# EasyEDA Pro project 四轮车板子.epro, schematic Schematic3
Create Date: 2023-07-01; Page Name: P1; Project Name: 国光_无敌车; Schematic Name: Schematic3; Update Date: 2023-07-01; Company: 嘉立创EDA; Page Size: A4; Version: V1.0
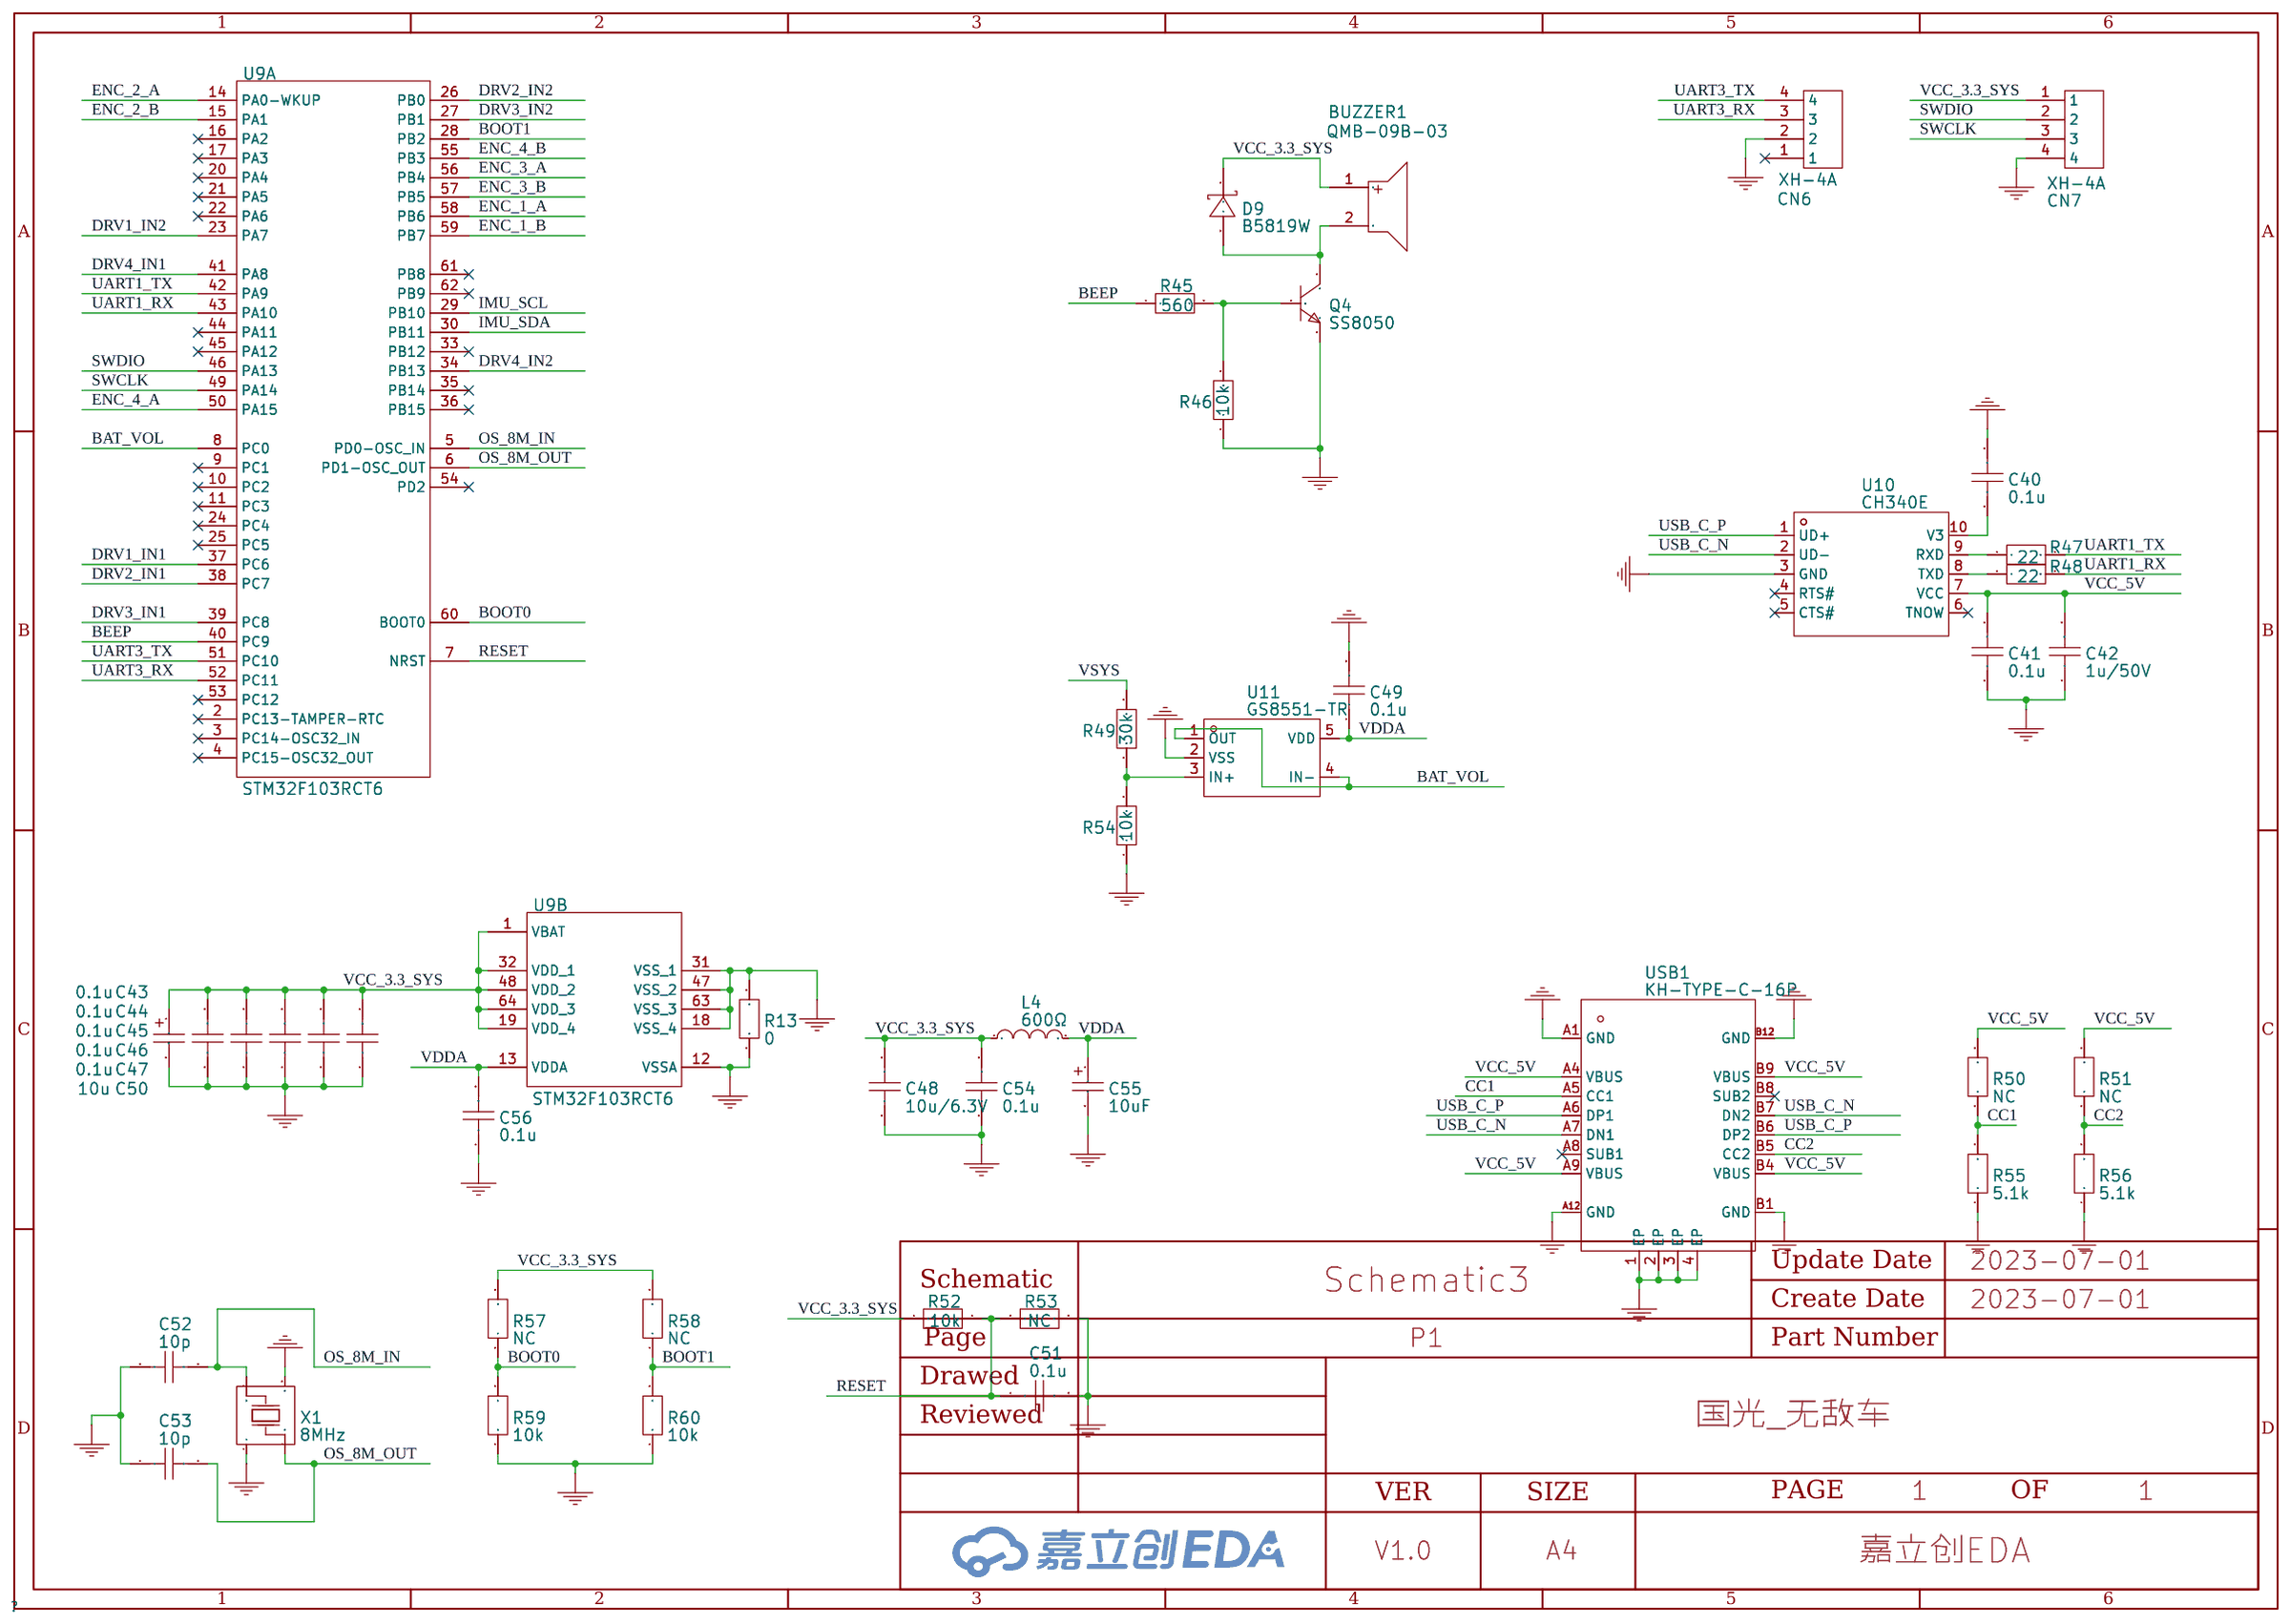
[diagram p0: schematic sheet]

## Parts
BUZZER1  QMB-09B-03  [BUZ-TH_BD9.0-P4.00-D0.6-FD]
C40  0.1u  [C0402]
C41  0.1u  [C0402]
C42  1u/50V  [C0603]
C43  0.1u  [C0402]
C44  0.1u  [C0402]
C45  0.1u  [C0402]
C46  0.1u  [C0402]
C47  0.1u  [C0402]
C48  10u/6.3V  [C0603]
C49  0.1u  [C0402]
C50  10u  [CAP-SMD_L3.2-W1.6-R-RD]
C51  0.1u  [C0402]
C52  10p  [C0402]
C53  10p  [C0402]
C54  0.1u  [C0402]
C55  10uF  [CAP-SMD_L3.2-W1.6-R-RD]
C56  0.1u  [C0402]
CN6  XH-4A  [CONN-TH_4P-P2.50_XH-4A]
CN7  XH-4A  [CONN-TH_4P-P2.50_XH-4A]
D9  B5819W  [SOD-123_L2.8-W1.8-LS3.7-RD]
L4  600Ω  [L1206]
Q4  SS8050  [SOT-23-3_L2.9-W1.3-P1.90-LS2.4-BR]
R13  0  [R0603]
R45  560  [R0402]
R46  10k  [R0402]
R47  22  [R0402]
R48  22  [R0402]
R49  30k  [R0402]
R50  NC  [R0402]
R51  NC  [R0402]
R52  10k  [R0402]
R53  NC  [R0402]
R54  10k  [R0402]
R55  5.1k  [R0402]
R56  5.1k  [R0402]
R57  NC  [R0402]
R58  NC  [R0402]
R59  10k  [R0402]
R60  10k  [R0402]
U9  STM32F103RCT6  [LQFP-64_L10.0-W10.0-P0.50-LS12.0-BL]  (sections 1,2)
U10  CH340E  [MSOP-10_L3.0-W3.0-P0.50-LS5.0-BL]
U11  GS8551-TR  [SOT-23-5_L3.0-W1.7-P0.95-LS2.8-BR]
USB1  KH-TYPE-C-16P  [USB-C-SMD_KH-TYPE-C-16P]
X1  8MHz  [OSC-SMD_4P-L3.2-W2.5-BL]

## Library data of the parts
BUZZER1 = QMB-09B-03: link: https://item.szlcsc.com/173200.html; 3DModel: BUZ-TH_D9.0-H5.5-P4.0; Supplier: LCSC; Manufacturer: HNDZ; Supplier Part: C96256; JLCPCB Part Class: ExtendedPart
C40 C41 C43-C47 C49 C51 C54 C56 = 0.1u: link: https://item.szlcsc.com/15869.html; 3DModel: C0402_L1.0-W0.5-H0.5
C42 = 1u/50V: link: https://item.szlcsc.com/362304.html; 3DModel: C0603_L1.6-W0.8-H0.8
C48 = 10u/6.3V: link: https://item.szlcsc.com/362304.html; 3DModel: C0603_L1.6-W0.8-H0.8
C50 = 10u: link: https://item.szlcsc.com/210648.html; 3DModel: CASE-A_L3.2-W1.6-H1.6; Supplier: LCSC; Manufacturer: AVX; Manufacturer Part: TAJA106K016RNJ; Supplier Part: C7171; JLCPCB Part Class: BasicPart
C52 C53 = 10p: link: https://item.szlcsc.com/15869.html; 3DModel: C0402_L1.0-W0.5-H0.5
C55 = 10uF: link: https://item.szlcsc.com/210648.html; 3DModel: CASE-A_L3.2-W1.6-H1.6; Supplier: LCSC; Manufacturer: AVX; Manufacturer Part: TAJA106K016RNJ; Supplier Part: C7171; JLCPCB Part Class: BasicPart
CN6 CN7 = XH-4A: link: https://atta.szlcsc.com/upload/public/pdf/source/20170919/C37815_1505787307039977083.pdf; Supplier: LCSC; Manufacturer: BOOMELE; Supplier Part: C37815; JLCPCB Part Class: ExtendedPart
D9 = B5819W: link: https://item.szlcsc.com/301422.html; Supplier: LCSC; Manufacturer: MDD; Supplier Part: C64885; JLCPCB Part Class: ExtendedPart
L4 = 600Ω: link: https://item.szlcsc.com/375393.html; 3DModel: L1206_L3.2-W1.6-H1.1; Supplier: LCSC; Manufacturer: FH; Manufacturer Part: CBW321609U601T; Supplier Part: C73732; JLCPCB Part Class: ExtendedPart
Q4 = SS8050: link: https://www.diodes.com/assets/Package-Files/SOT23.pdf; 3DModel: SOT-23-3P_L2.9-W1.3-H1.0-LS2.4-P0.95; Supplier: LCSC; Supplier Part: C908250; Manufacturer: FUXINSEMI; JLCPCB Part Class: ExtendedPart
R13 = 0: 3DModel: R0603_L1.6-W0.8-H0.8; link: https://www.mouser.in/datasheet/2/447/PYu_RT_1_to_0_01_RoHS_L_11-1669912.pdf
R45 = 560: link: https://item.szlcsc.com/323315.html; 3DModel: R0402_L1.0-W0.5-H0.5
R46 R52 R54 R59 R60 = 10k: link: https://item.szlcsc.com/323315.html; 3DModel: R0402_L1.0-W0.5-H0.5
R47 R48 = 22: link: https://item.szlcsc.com/323315.html; 3DModel: R0402_L1.0-W0.5-H0.5
R49 = 30k: link: https://item.szlcsc.com/323315.html; 3DModel: R0402_L1.0-W0.5-H0.5
R50 R51 R53 R57 R58 = NC: link: https://item.szlcsc.com/323315.html; 3DModel: R0402_L1.0-W0.5-H0.5
R55 R56 = 5.1k: link: https://item.szlcsc.com/323315.html; 3DModel: R0402_L1.0-W0.5-H0.5
U9 = STM32F103RCT6: link: https://item.szlcsc.com/92458.html; 3DModel: LQFP-64_L10.0-W10.0-H1.4-LS12.0-P0.50; Supplier: LCSC; Manufacturer: STMicroelectronics; image: //image.lceda.cn/szlcsc/C8323.jpg; Supplier Part: C8323; JLCPCB Part Class: ExtendedPart
U10 = CH340E: link: https://item.szlcsc.com/221388.html; 3DModel: MSOP-10_L3.0-W3.0-H1.1-LS5.0-P0.50; Supplier: LCSC; Manufacturer: WCH; Supplier Part: C99652; JLCPCB Part Class: ExtendedPart
U11 = GS8551-TR: link: https://item.szlcsc.com/236104.html; 3DModel: SOT-23-5_L2.9-W1.6-H1.1-LS2.8-P0.95; Supplier: LCSC; Supplier Part: C157715; Manufacturer: Gainsil; JLCPCB Part Class: ExtendedPart
USB1 = KH-TYPE-C-16P: 3DModel: USB-C_SMD-TYPE-C-31-M-12; link: https://item.szlcsc.com/747093.html; Supplier: LCSC; Supplier Part: C709357; Manufacturer: ShenzhenKinghelmElec; JLCPCB Part Class: ExtendedPart
X1 = 8MHz: link: https://item.szlcsc.com/15866.html; 3DModel: OSC-SMD_4P-L3.2-W2.5-H1.0; Supplier: LCSC; Supplier Part: C400090; Manufacturer: ZhejiangAbelElec; Manufacturer Part: TAXM8M4RDBCCT2T; JLCPCB Part Class: ExtendedPart

## Nets
AGND: C49.2 C55.2 C56.1 R13.1 R54.1 U9.12(VSSA) U11.2(VSS)
GND: C40.2 C41.1 C42.1 C43.1 C44.1 C45.1 C46.1 C47.1 C48.1 C50.2 C51.2 C52.1 C53.1 C54.1 CN6.2 CN7.4 Q4.2(E) R13.2 R46.1 R53.2 R55.1 R56.1 R59.1 R60.1 U9.18(VSS_4) U9.31(VSS_1) U9.47(VSS_2) U9.63(VSS_3) U10.3(GND) USB1.1(EP) USB1.2(EP) USB1.3(EP) USB1.4(EP) USB1.A1(GND) USB1.A12(GND) USB1.B1(GND) USB1.B12(GND) X1.2 X1.4
VCC_3.3_SYS: BUZZER1.1 C43.2 C44.2 C45.2 C46.2 C47.2 C48.2 C50.1 C54.2 CN7.1 D9.1(K) L4.1 R52.1 R57.2 R58.2 U9.1(VBAT) U9.19(VDD_4) U9.32(VDD_1) U9.48(VDD_2) U9.64(VDD_3)
VCC_5V: C41.2 C42.2 R50.2 R51.2 U10.7(VCC) USB1.A4(VBUS) USB1.A9(VBUS) USB1.B4(VBUS) USB1.B9(VBUS)
VDDA: C49.1 C55.1 C56.2 L4.2 U9.13(VDDA) U11.5(VDD)
BAT_VOL: U9.8(PC0) U11.1(OUT) U11.4(IN-)
BEEP: R45.1 U9.40(PC9)
BOOT0: R57.1 R59.2 U9.60(BOOT0)
BOOT1: R58.1 R60.2 U9.28(PB2)
CC1: R50.1 R55.2 USB1.A5(CC1)
CC2: R51.1 R56.2 USB1.B5(CC2)
DRV1_IN1: U9.37(PC6)
DRV1_IN2: U9.23(PA7)
DRV2_IN1: U9.38(PC7)
DRV2_IN2: U9.26(PB0)
DRV3_IN1: U9.39(PC8)
DRV3_IN2: U9.27(PB1)
DRV4_IN1: U9.41(PA8)
DRV4_IN2: U9.34(PB13)
ENC_1_A: U9.58(PB6)
ENC_1_B: U9.59(PB7)
ENC_2_A: U9.14(PA0-WKUP)
ENC_2_B: U9.15(PA1)
ENC_3_A: U9.56(PB4)
ENC_3_B: U9.57(PB5)
ENC_4_A: U9.50(PA15)
ENC_4_B: U9.55(PB3)
IMU_SCL: U9.29(PB10)
IMU_SDA: U9.30(PB11)
OS_8M_IN: C52.2 U9.5(PD0-OSC_IN) X1.3
OS_8M_OUT: C53.2 U9.6(PD1-OSC_OUT) X1.1
RESET: C51.1 R52.2 R53.1 U9.7(NRST)
SWCLK: CN7.3 U9.49(PA14)
SWDIO: CN7.2 U9.46(PA13)
UART1_RX: R48.2 U9.43(PA10)
UART1_TX: R47.2 U9.42(PA9)
UART3_RX: CN6.3 U9.52(PC11)
UART3_TX: CN6.4 U9.51(PC10)
USB_C_N: U10.2(UD-) USB1.A7(DN1) USB1.B7(DN2)
USB_C_P: U10.1(UD+) USB1.A6(DP1) USB1.B6(DP2)
VSYS: R49.2
Net-(BUZZER1-2): BUZZER1.2 D9.2(A) Q4.3(C)
Net-(C40-1): C40.1 U10.10(V3)
Net-(Q4-1): Q4.1(B) R45.2 R46.2
Net-(R47-1): R47.1 U10.9(RXD)
Net-(R48-1): R48.1 U10.8(TXD)
Net-(R49-1): R49.1 R54.2 U11.3(IN+)

Not connected (* = marked no-connect by the designer): CN6 1*; U9 2(PC13-TAMPER-RTC)* 3(PC14-OSC32_IN)* 4(PC15-OSC32_OUT)* 9(PC1)* 10(PC2)* 11(PC3)* 16(PA2)* 17(PA3)* 20(PA4)* 21(PA5)* 22(PA6)* 24(PC4)* 25(PC5)* 33(PB12)* 35(PB14)* 36(PB15)* 44(PA11)* 45(PA12)* 53(PC12)* 54(PD2)* 61(PB8)* 62(PB9)*; U10 4(RTS#)* 5(CTS#)* 6(TNOW)*; USB1 A8(SUB1)* B8(SUB2)*
